# Altium schematic sheet Main.SchDoc
size A2; SheetNumber: 1; SheetTotal: 2; SPICEModelCacheKIWVXNNP: <root> / <DocumentId>KIWVXNNP</DocumentId> / <CacheFrame Number="0"> / <Model Name="cap" Kind="MDL"> / <Text>*Default semiconductor capacitor / .MODEL CAP C()</Text> / </Model> / <Model Name="led2" Kind="MDL"> / <Text>*Typ RED,GREEN,YELLOW,AMBER GaAs LED: Vf=2.1V Vr=4V If=40mA trr=3uS / *LED Pinout: 1=A, 2=K / .MODEL LED2 D (IS=93.1P RS=42M N=4.61 BV=4 IBV=10U / + CJO=2.97P VJ=.75 M=.333 TT=4.32U)</Text> / </Model> / <Model Name="skydiode" Kind="MDL"> / <Text>*Default Schottky Diode / *Schottky Diode Pinout: A,K / .MODEL SKYDIODE D(EG=0.69 XTI=2)</Text> / </Model> / </CacheFrame> / </root>
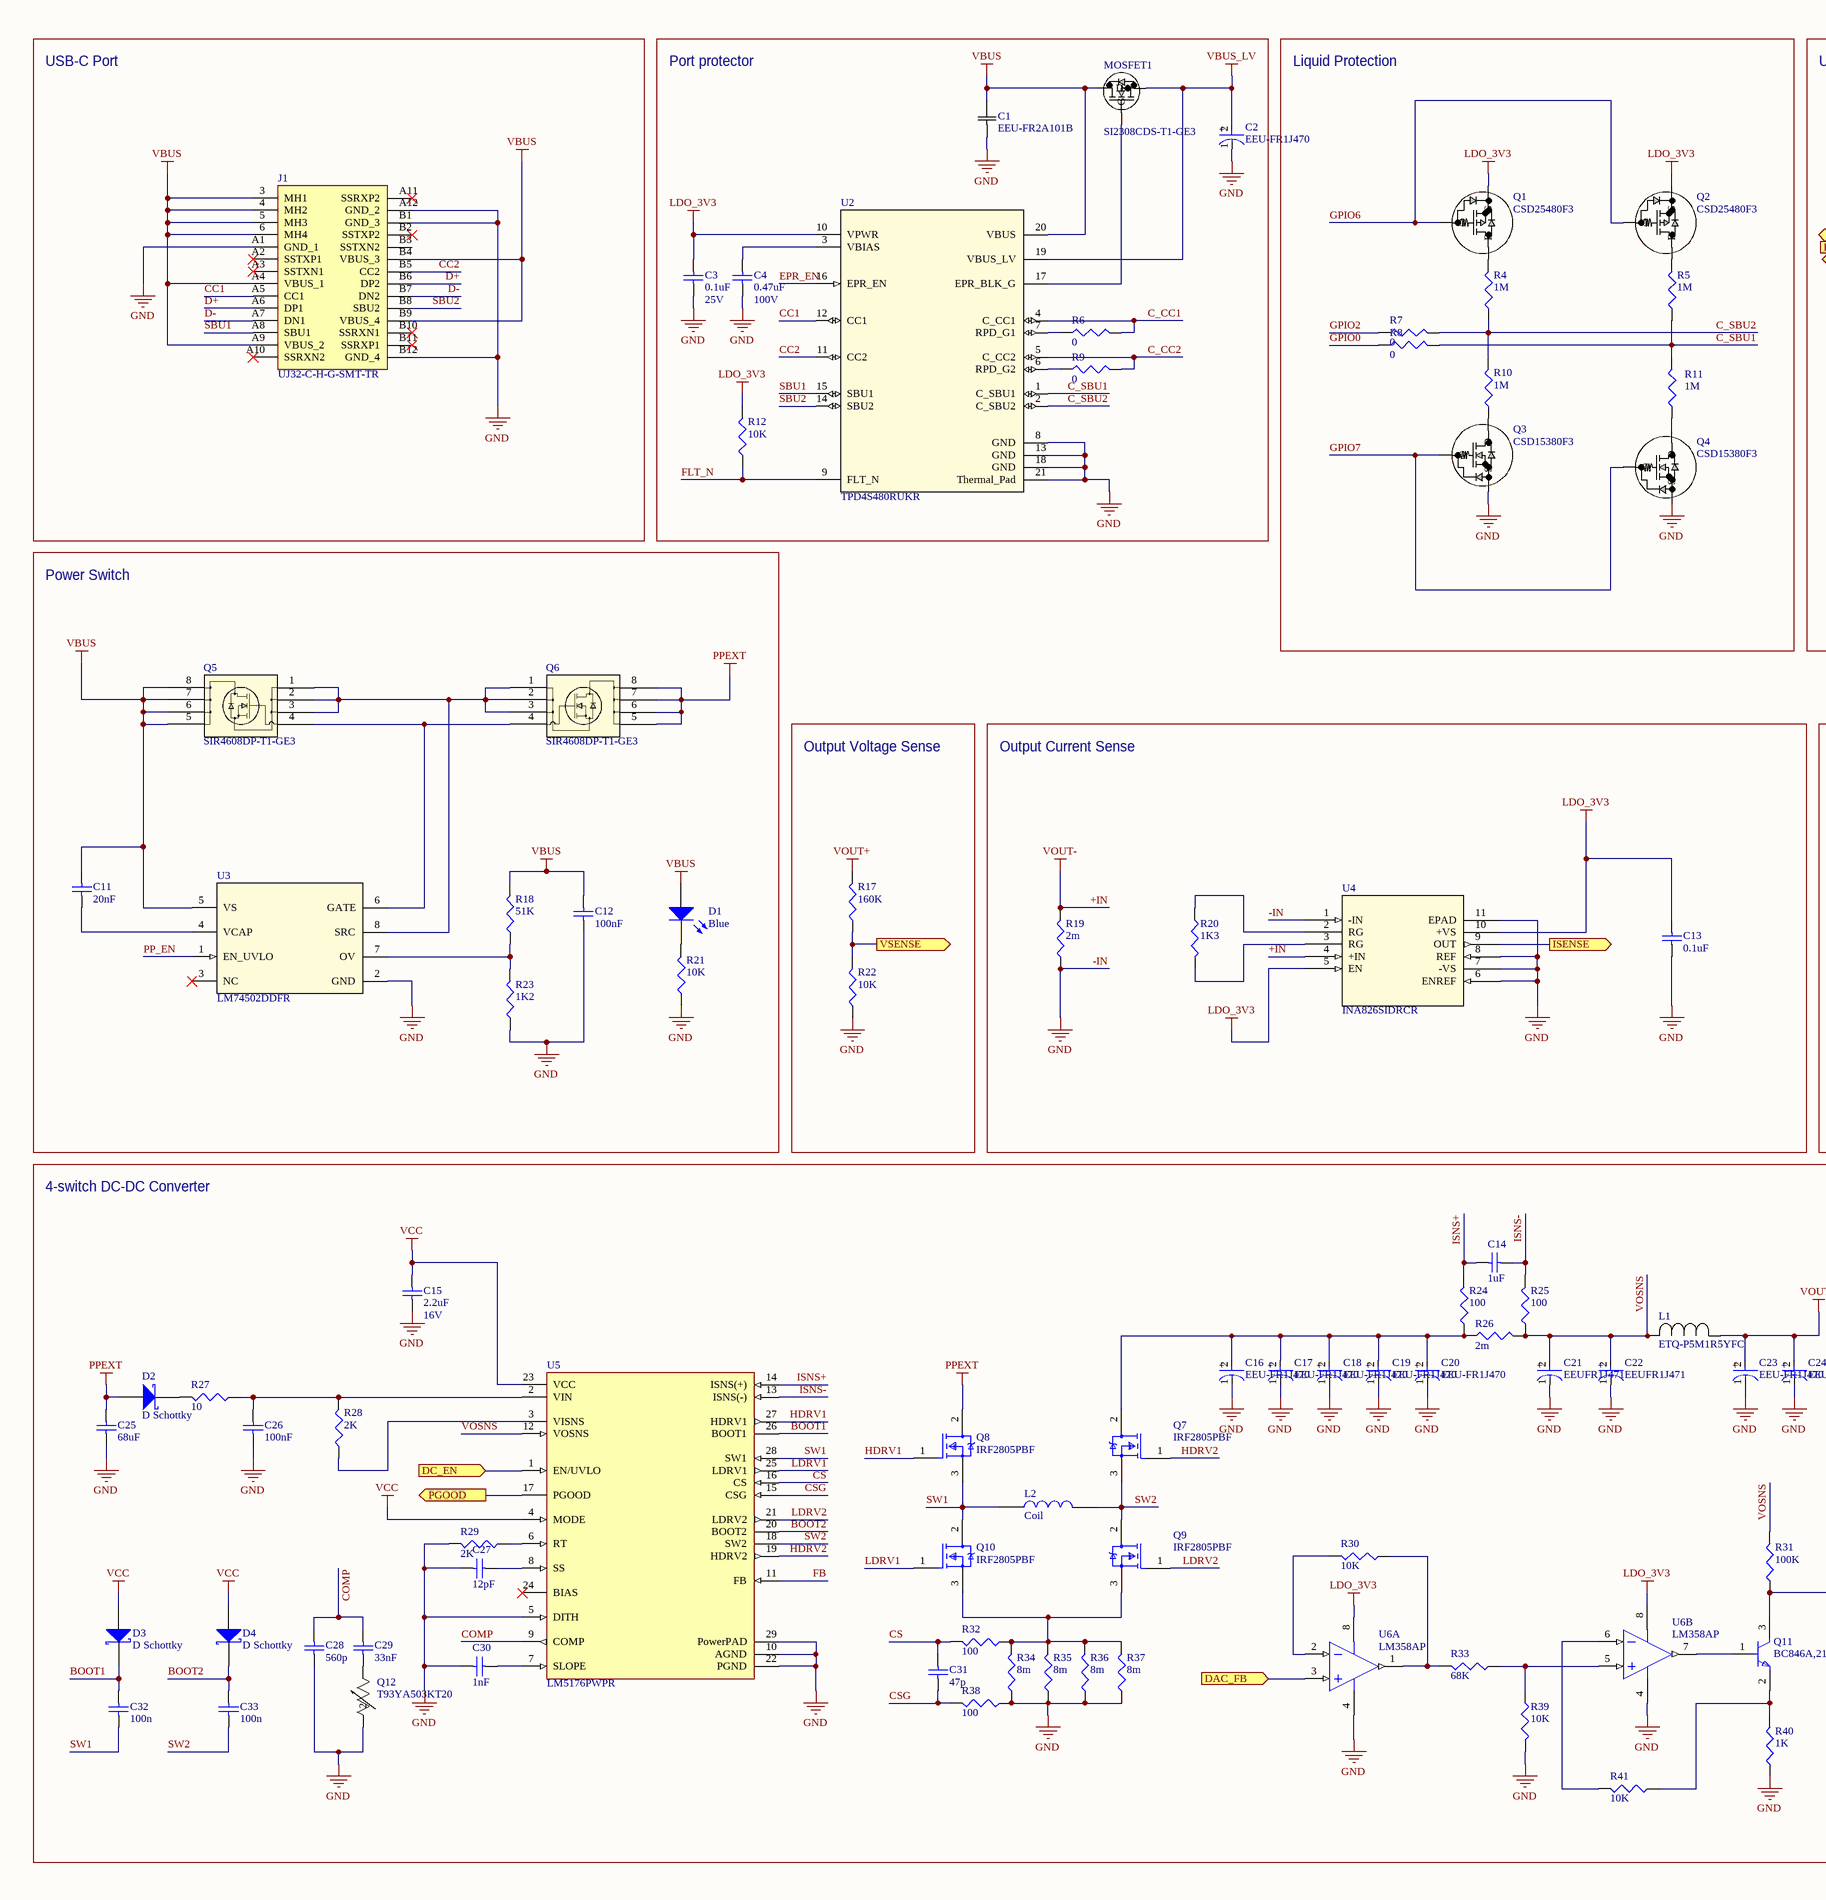
[diagram p0: Main.SchDoc, left]
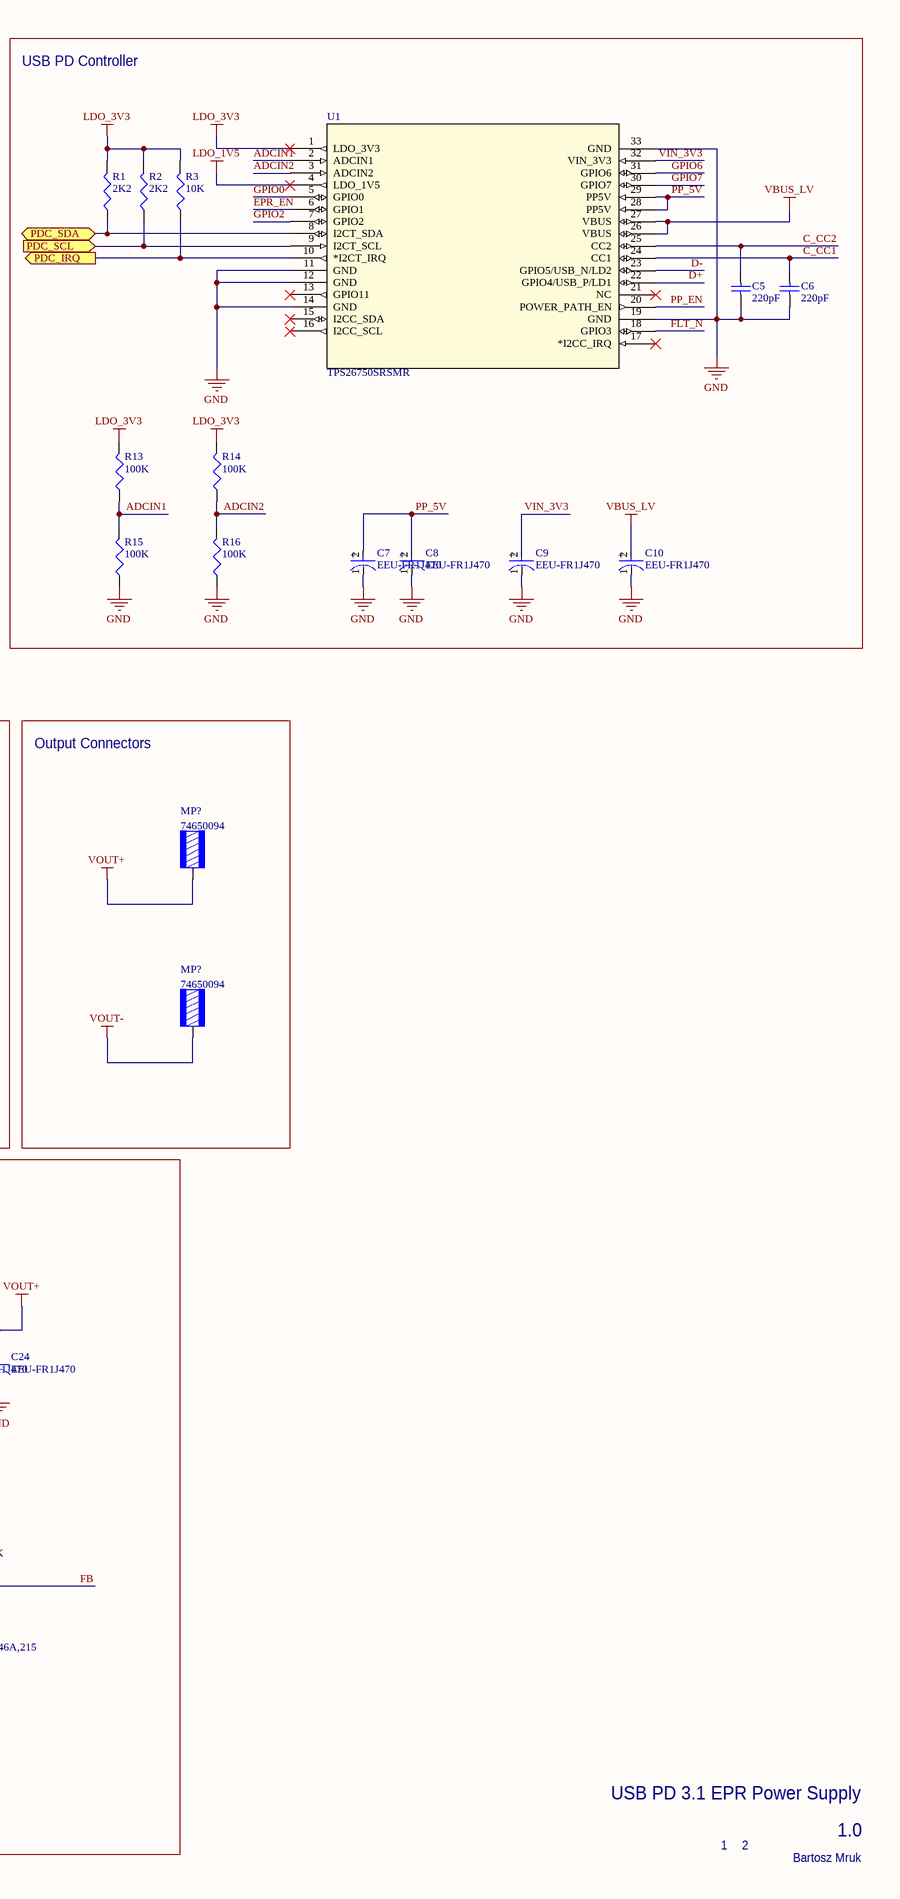
[diagram p1: Main.SchDoc, right]

## Parts
(Parts that share a designator on the sheet are numbered #1, #2 ... from top to bottom, then left to right.)
C1  EEU-FR2A101B  [CAP_EEU-FR2A101B_PAN]
C2  EEU-FR1J470  [FP-EEU-FR1J470-MFG]
C3  25V  value 0.1uF  [C1206]
C4  100V  value 0.47uF  [C1206]
C5  value 220pF  [C1206]  (hidden comment: Cap Semi)
C6  value 220pF  [C1206]  (hidden comment: Cap Semi)
C7  EEU-FR1J470  [FP-EEU-FR1J470-MFG]
C8  EEU-FR1J470  [FP-EEU-FR1J470-MFG]
C9  EEU-FR1J470  [FP-EEU-FR1J470-MFG]
C10  EEU-FR1J470  [FP-EEU-FR1J470-MFG]
C11  value 20nF  [C1206]  (hidden comment: at least 13V)
C12  value 100nF  [C1206]  (hidden comment: Cap Semi)
C13  value 0.1uF  [1608[0603]]
C14  value 1uF  [C1206]  (hidden comment: Cap Semi)
C15  16V  value 2.2uF  [C1206]
C16  EEU-FR1J470  [FP-EEU-FR1J470-MFG]
C17  EEU-FR1J470  [FP-EEU-FR1J470-MFG]
C18  EEU-FR1J470  [FP-EEU-FR1J470-MFG]
C19  EEU-FR1J470  [FP-EEU-FR1J470-MFG]
C20  EEU-FR1J470  [FP-EEU-FR1J470-MFG]
C21  EEUFR1J471  [FP-RAD-TH-D_12_5_0_5-L_25-MFG]
C22  EEUFR1J471  [FP-RAD-TH-D_12_5_0_5-L_25-MFG]
C23  EEU-FR1J470  [FP-EEU-FR1J470-MFG]
C24  EEU-FR1J470  [FP-EEU-FR1J470-MFG]
C25  value 68uF  [C1206]  (hidden comment: Cap Semi)
C26  value 100nF  [C1206]  (hidden comment: Cap Semi)
C27  value 12pF  [C1206]  (hidden comment: Cap Semi)
C28  value 560p  [C1206]  (hidden comment: Cap Semi)
C29  value 33nF  [C1206]  (hidden comment: Cap Semi)
C30  value 1nF  [C1206]  (hidden comment: Cap Semi)
C31  value 47p  [C1206]  (hidden comment: Cap Semi)
C32  value 100n  [C1206]  (hidden comment: Cap Semi)
C33  value 100n  [C1206]  (hidden comment: Cap Semi)
D1  Blue  [3.2X1.6X1.1]
D2  D Schottky  [SMB]
D3  D Schottky  [SMB]
D4  D Schottky  [SMB]
J1  UJ32-C-H-G-SMT-TR  [UJ32CHGSMTTR]
L1  ETQ-P5M1R5YFC  [IND_PCC-M1054M_PAN]
L2  Coil  [744711003]
MOSFET1  SI2308CDS-T1-GE3  [SOT-23_TO-236_VIS]
MP?#1  74650094  [74650094]
MP?#2  74650094  [74650094]
Q1  CSD25480F3  [PICOSTAR3_YJM_TEX]
Q2  CSD25480F3  [PICOSTAR3_YJM_TEX]
Q3  CSD15380F3  [PICOSTAR3_YJM_TEX]
Q4  CSD15380F3  [PICOSTAR3_YJM_TEX]
Q5  SIR4608DP-T1-GE3  [POWERPAK_SO-8_SINGLE_VIS]
Q6  SIR4608DP-T1-GE3  [POWERPAK_SO-8_SINGLE_VIS]
Q7  IRF2805PBF  [FP-PG-TO220-3-MFG]
Q8  IRF2805PBF  [FP-PG-TO220-3-MFG]
Q9  IRF2805PBF  [FP-PG-TO220-3-MFG]
Q10  IRF2805PBF  [FP-PG-TO220-3-MFG]
Q11  BC846A,215  [FP-SOT23-IPC_A]
Q12  T93YA503KT20  [TRIM_503KT20_VIS]
R1  value 2K2  [J1-0603]  (hidden comment: Res3)
R2  value 2K2  [J1-0603]  (hidden comment: Res3)
R3  value 10K  [J1-0603]  (hidden comment: Res3)
R4  value 1M  [J1-0603]  (hidden comment: Res3)
R5  value 1M  [J1-0603]  (hidden comment: Res3)
R6  value 0  [J1-0603]  (hidden comment: Res3)
R7  value 0  [J1-0603]  (hidden comment: Res3)
R8  value 0  [J1-0603]  (hidden comment: Res3)
R9  value 0  [J1-0603]  (hidden comment: Res3)
R10  value 1M  [J1-0603]  (hidden comment: Res3)
R11  value 1M  [J1-0603]  (hidden comment: Res3)
R12  value 10K  [J1-0603]  (hidden comment: Res3)
R13  value 100K  [J1-0603]  (hidden comment: Res3)
R14  value 100K  [J1-0603]  (hidden comment: Res3)
R15  value 100K  [J1-0603]  (hidden comment: Res3)
R16  value 100K  [J1-0603]  (hidden comment: Res3)
R17  value 160K  [J1-0603]  (hidden comment: Res3)
R18  value 51K  [J1-0603]  (hidden comment: Res3)
R19  value 2m  [RESC6332]  (hidden comment: Res3)
R20  value 1K3  [J1-0603]  (hidden comment: Res3)
R21  value 10K  [J1-0603]  (hidden comment: Res3)
R22  value 10K  [J1-0603]  (hidden comment: Res3)
R23  value 1K2  [J1-0603]  (hidden comment: Res3)
R24  value 100  [RESC6332]  (hidden comment: Res3)
R25  value 100  [RESC6332]  (hidden comment: Res3)
R26  value 2m  [RESC6332]  (hidden comment: Res3)
R27  value 10  [J1-0603]  (hidden comment: Res3)
R28  value 2K  [J1-0603]  (hidden comment: Res3)
R29  value 2K  [J1-0603]  (hidden comment: Res3)
R30  value 10K  [J1-0603]  (hidden comment: Res3)
R31  value 100K  [J1-0603]  (hidden comment: Res3)
R32  value 100  [RESC6332]  (hidden comment: Res3)
R33  value 68K  [J1-0603]  (hidden comment: Res3)
R34  value 8m  [RESC6332]  (hidden comment: Res3)
R35  value 8m  [RESC6332]  (hidden comment: Res3)
R36  value 8m  [RESC6332]  (hidden comment: Res3)
R37  value 8m  [RESC6332]  (hidden comment: Res3)
R38  value 100  [RESC6332]  (hidden comment: Res3)
R39  value 10K  [J1-0603]  (hidden comment: Res3)
R40  value 1K  [J1-0603]  (hidden comment: Res3)
R41  value 10K  [J1-0603]  (hidden comment: Res3)
U1  TPS26750SRSMR  [VQFN32_RSM_TEX]
U2  TPD4S480RUKR  [RUK0020B-IPC_A]
U3  LM74502DDFR  [DDF0008A-IPC_A]
U4  INA826SIDRCR  [DRC10_TEX]
U5  LM5176PWPR  [FP-PWP0028C-IPC_C]
U6  LM358AP  [P0008A]  (parts A,B of 2)

## Blocks framed on the sheet
USB-C Port: J1
Port protector: C1-C4 MOSFET1 R6 R9 R12 U2
Liquid Protection: Q1-Q4 R4 R5 R7 R8 R10 R11
USB PD Controller: C5-C10 R1-R3 R13-R16 U1
Power Switch: C11 C12 D1 Q5 Q6 R18 R21 R23 U3
Output Voltage Sense: R17 R22
Output Current Sense: C13 R19 R20 U4
Output Connectors: MP?#1 MP?#2
4-switch DC-DC Converter: C14-C33 D2-D4 L1 L2 Q7-Q12 R24-R41 U5 U6

## Ports
DAC_FB (in, see MicroC[1A]), DC_EN (in, see MicroC[1A]), ISENSE (out, see MicroC[3A]), PDC_IRQ (out, see MicroC[1A]), PDC_SCL (in, see MicroC[1A]), PDC_SDA (bidir, see MicroC[1A]), PGOOD (out, see MicroC[1A]), VSENSE (out, see MicroC[3A])

## Nets
+IN: MP?#2.1 R19.2 U4.4(+IN)  [also labelled VOUT-]
-IN: C1.1 C2.1(C) C3.1 C4.1 C5.1 C6.1 C7.1(C) C8.1(C) C9.1(C) C10.1(C) C12.1 C13.1 C15.1 C16.1(C) C17.1(C) C18.1(C) C19.1(C) C20.1(C) C21.1(C) C22.1(C) C23.1(C) C24.1(C) C25.1 C26.1 C27.2 C28.1 C30.2 J1.A1(GND_1) J1.A12(GND_2) J1.B1(GND_3) J1.B12(GND_4) Q3.2(S) Q4.2(S) Q12.2 R15.1 R16.1 R19.1 R21.1 R22.1 R23.1 R29.2 R34.1 R35.1 R36.1 R37.1 R38.1 R39.2 R40.1 U1.11(GND) U1.12(GND) U1.14(GND) U1.19(GND) U1.33(GND) U2.8(GND) U2.13(GND) U2.18(GND) U2.21(Thermal_Pad) U3.2(GND) U4.1(-IN) U4.6(ENREF) U4.7(-VS) U4.8(REF) U4.11(EPAD) U5.5(DITH) U5.10(AGND) U5.22(PGND) U5.29(PowerPAD) U6.4(GND)  [also labelled GND]
LDO_1V5: U1.4(LDO_1V5)
LDO_3V3: C3.2 C13.2 Q1.2(S) Q2.2(S) R1.2 R2.2 R3.2 R12.2 R13.2 R14.2 U1.1(LDO_3V3) U2.10(VPWR) U4.5(EN) U4.10(+VS) U6.8(VCC)
PPEXT: C25.2 D2.1(A) Q6.5 Q6.6 Q6.7 Q6.8 Q8.2(D)
VBUS: C1.2 C11.2 C12.2 D1.1(A) J1.3(MH1) J1.4(MH2) J1.5(MH3) J1.6(MH4) J1.A4(VBUS_1) J1.A9(VBUS_2) J1.B4(VBUS_3) J1.B9(VBUS_4) MOSFET1.2(D) Q5.5 Q5.6 Q5.7 Q5.8 R18.2 U2.20(VBUS) U3.5(VS)
VBUS_LV: C2.2(A) C10.2(A) MOSFET1.3(S) U1.26(VBUS) U1.27(VBUS) U2.19(VBUS_LV)
VCC: C15.2 D3.1(A) D4.1(A) U5.4(MODE) U5.23(VCC)
VOUT+: C23.2(A) C24.2(A) L1.1 MP?#1.1 R17.2
ADCIN1: R13.1 R15.2 U1.2(ADCIN1)
ADCIN2: R14.1 R16.2 U1.3(ADCIN2)
BOOT1: C32.2 D3.2(K) U5.26(BOOT1)
BOOT2: C33.2 D4.2(K) U5.20(BOOT2)
C_CC1: C6.2 R6.2 U1.24(CC1) U2.4(C_CC1)
C_CC2: C5.2 R9.2 U1.25(CC2) U2.5(C_CC2)
C_SBU1: R5.1 R8.2 R11.2 U2.1(C_SBU1)
C_SBU2: R4.1 R7.2 R10.2 U2.2(C_SBU2)
CC1: J1.A5(CC1) U2.12(CC1)
CC2: J1.B5(CC2) U2.11(CC2)
COMP: C28.2 C29.2 U5.9(COMP)
CS: C31.2 R32.2 U5.16(CS)
CSG: C31.1 R38.2 U5.15(CSG)
D+: J1.A6(DP1) J1.B6(DP2) U1.22(GPIO4/USB_P/LD1)
D-: J1.A7(DN1) J1.B7(DN2) U1.23(GPIO5/USB_N/LD2)
DAC_FB: U6.3(1IN+) ; port DAC_FB
DC_EN: U5.1(EN/UVLO) ; port DC_EN
EPR_EN: U1.6(GPIO1) U2.16(EPR_EN)
FB: Q11.3(C) R31.1 U5.11(FB)
FLT_N: R12.1 U1.18(GPIO3) U2.9(FLT_N)
GPIO0: R8.1 U1.5(GPIO0)
GPIO2: R7.1 U1.7(GPIO2)
GPIO6: Q1.1(G) Q2.1(G) U1.31(GPIO6)
GPIO7: Q3.1(G) Q4.1(G) U1.30(GPIO7)
HDRV1: Q8.1(G) U5.27(HDRV1)
HDRV2: Q7.1(G) U5.19(HDRV2)
ISENSE: U4.9(OUT) ; port ISENSE
ISNS+: C14.1 R24.2 U5.14(ISNS(+))
ISNS-: C14.2 R25.2 U5.13(ISNS(-))
LDRV1: Q10.1(G) U5.25(LDRV1)
LDRV2: Q9.1(G) U5.21(LDRV2)
PDC_IRQ: R3.1 U1.10(*I2CT_IRQ) ; port PDC_IRQ
PDC_SCL: R2.1 U1.9(I2CT_SCL) ; port PDC_SCL
PDC_SDA: R1.1 U1.8(I2CT_SDA) ; port PDC_SDA
PGOOD: U5.17(PGOOD) ; port PGOOD
PP_5V: C7.2(A) C8.2(A) U1.28(PP5V) U1.29(PP5V)
PP_EN: U1.20(POWER_PATH_EN) U3.1(EN_UVLO)
SBU1: J1.A8(SBU1) U2.15(SBU1)
SBU2: J1.B8(SBU2) U2.14(SBU2)
SW1: C32.1 L2.1 Q8.3(S) Q10.2(D) U5.28(SW1)
SW2: C33.1 L2.2 Q7.3(S) Q9.2(D) U5.18(SW2)
VIN_3V3: C9.2(A) U1.32(VIN_3V3)
VOSNS: C21.2(A) C22.2(A) L1.2 R25.1 R26.2 R31.2 U5.12(VOSNS)
VSENSE: R17.1 R22.2 ; port VSENSE
NetC4_2: C4.2 U2.3(VBIAS)
NetC11_1: C11.1 U3.4(VCAP)
NetC16_2: C16.2(A) C17.2(A) C18.2(A) C19.2(A) C20.2(A) Q7.2(D) R24.1 R26.1
NetC26_2: C26.2 R27.1 R28.2 U5.2(VIN)
NetC27_1: C27.1 U5.8(SS)
NetC29_1: C29.1 Q12.1
NetC30_1: C30.1 U5.7(SLOPE)
NetD1_2: D1.2(K) R21.2
NetD2_2: D2.2(K) R27.2
NetMOSFET1_1: MOSFET1.1(G) U2.17(EPR_BLK_G)
NetQ1_3: Q1.3(D) R4.2
NetQ2_3: Q2.3(D) R5.2
NetQ3_3: Q3.3(D) R10.1
NetQ4_3: Q4.3(D) R11.1
NetQ5_1: Q5.1 Q5.2 Q5.3 Q6.1 Q6.2 Q6.3 U3.8(SRC)
NetQ5_4: Q5.4 Q6.4 U3.6(GATE)
NetQ9_3: Q9.3(S) Q10.3(S) R32.1 R34.2 R35.2 R36.2 R37.2
NetQ11_1: Q11.1(B) U6.7(2OUT)
NetQ11_2: Q11.2(E) R40.2 R41.1
NetR6_1: R6.1 U2.7(RPD_G1)
NetR9_1: R9.1 U2.6(RPD_G2)
NetR18_1: R18.1 R23.2 U3.7(OV)
NetR20_1: R20.1 U4.2(RG)
NetR20_2: R20.2 U4.3(RG)
NetR28_1: R28.1 U5.3(VISNS)
NetR29_1: R29.1 U5.6(RT)
NetR30_1: R30.1 R33.2 U6.1(1OUT)
NetR30_2: R30.2 U6.2(1IN-)
NetR33_1: R33.1 R39.1 U6.5(2IN+)
NetR41_2: R41.2 U6.6(2IN-)

Not connected (* = marked no-connect by the designer): J1 A2(SSTXP1)* A3(SSTXN1)* A10(SSRXN2)* A11(SSRXP2)* B2(SSTXP2)* B3(SSTXN2) B10(SSRXN1)* B11(SSRXP1)*; U1 13(GPIO11)* 15(I2CC_SDA)* 16(I2CC_SCL)* 17(*I2CC_IRQ)* 21(NC)*; U3 3(NC)*; U5 24(BIAS)*

## Notes on the sheet
- USB PD 3.1 EPR Power Supply
- 1
- 2
- 1.0
- Bartosz Mruk
- (in symbol CMP-05427-000066-1) +
- (in symbol CMP-05427-000281-1) +

## Library data of the parts
C1 = EEU-FR2A101B: No Description Available; Manufacturer_Name: Panasonic; Copyright: Copyright (C) 2025 Ultra Librarian. All rights reserved.; Manufacturer_Part_Number: EEU-FR2A101B
C2 C7-C10 C16-C20 C23 C24 = CMP-05427-000066-1: CAP ALUM 47UF 20% 63V RADIAL; ESR (Equivalent Series Resistance): 210mR; Lead Diameter: 0.5mm; Life (Hours): 5000Hour; Ripple Current (AC): 284mA; Height - Seated (Max): 0.5inch; Radiation Hardening: No; Termination: Radial; Contact Plating: Tin; Length: 11.2mm; Tolerance: 20%; Voltage: 63V; Max Operating Temperature: 105°C; Construction: Cylindrical; Lead Free: Lead Free; Series: FR; Mount: Through Hole; Lead Pitch: 2.5mm; Capacitance: 47uF; Case/Package: Radial; Voltage Rating (DC): 63V; Diameter: 6.3mm; Impedance: 210mR; RoHS Compliant: Yes; Height: 11.2mm; REACH SVHC: No SVHC; Package Quantity: 200; Ripple Current: 284mA; Voltage Rating: 63V; Packaging: Bulk; Min Operating Temperature: -40°C
C3-C6 C11-C15 C25-C33 = Cap Semi: Capacitor (Semiconductor SIM Model); Published: 8-Jun-2000; LatestRevisionDate: 29-May-2009; LatestRevisionNote: IPC-7351 Footprint Added.; PackageReference: C1206; Publisher: Altium Limited; PackageDescription: Chip Capacitor
C21 C22 = CMP-05427-000281-1: Aluminum Electrolytic Capacitors (Radial Lead Type) 470uF ±20% 63V; Impedance: 27mR; Lead Diameter: 0.6mm; Ripple Current: 1.995A; Life (Hours): 10000Hour; Series: FR; Tolerance: 20%; Max Operating Temperature: 105°C; Diameter: 12.5mm; Height - Seated (Max): 1.063inch; Termination: Radial; Voltage Rating: 63V; Contact Plating: Tin; Height: 25mm; Case/Package: Radial; Packaging: Bulk; Length: 25mm; Mount: Through Hole; Construction: Cylindrical; Package Quantity: 100; Ripple Current (AC): 1.995A; Radiation Hardening: No; Voltage: 63V; Capacitance: 470uF; RoHS Compliant: Yes; Min Operating Temperature: -40°C; ESR (Equivalent Series Resistance): 27mR; Lead Free: Lead Free; Lead Pitch: 5mm; Voltage Rating (DC): 63V
D1 = LED2: Typical RED, GREEN, YELLOW, AMBER GaAs LED; Published: 8-Jun-2000; LatestRevisionDate: 17-Jul-2002; LatestRevisionNote: Re-released for DXP Platform.; PackageVersion: Feb-2002; PackageReference: 3.2X1.6X1.1; Publisher: Altium Limited; PackageDescription: SM LED; 2 Flat Leads
D2-D4 = D Schottky: Schottky Diode; Published: 8-Jun-2000; LatestRevisionDate: 17-Jul-2002; LatestRevisionNote: Re-released for DXP Platform.; PackageReference: SMB; Publisher: Altium Limited; PackageDescription: DO-214-AA/SMB; 2 C-Bend Leads; Body 5.3 x 3.6 mm, inc. leads (LxW); Code_JEDEC: DO-214-AA
J1 = UJ32-C-H-G-SMT-TR: UJ32-C-H-G-SMT-TR - Type C, USB 3.2 Gen 2x2, 20 Gbps, 20 Vac, 5 A, Right Angle, Gold Flash, Surface Mount, Black Insulator, USB Receptacle; Manufacturer_Name: Same Sky; Geometry.Height: 3.71mm; Mouser Part Number: 179-UJ32CHGSMTTR; Mouser Price/Stock: https://www.mouser.co.uk/ProductDetail/CUI-Devices/UJ32-C-H-G-SMT-TR?qs=vvQtp7zwQdNJg60%252BwYKIHw%3D%3D; Manufacturer_Part_Number: UJ32-C-H-G-SMT-TR; Datasheet Link: https://www.sameskydevices.com/product/resource/UJ32-C-H-G-SMT-TR.pdf
L1 = ETQ-P5M1R5YFC: No Description Available; Manufacturer_Name: Panasonic; Copyright: Copyright (C) 2025 Ultra Librarian. All rights reserved.; Manufacturer_Part_Number: ETQ-P5M1R5YFC
MOSFET1 = SI2308CDS-T1-GE3: N-CHANNEL 60-V (D-S) MOSFET; Manufacturer_Name: Vishay; Copyright: Copyright (C) 2025 Ultra Librarian. All rights reserved.; Manufacturer_Part_Number: SI2308CDS-T1-GE3
MP?#1 MP?#2 = CMP-03913-89699612-2: WP-THRBU REDCUBE Bush, THR_open; Current Rating: 85A; Packaging: Bulk; Min Operating Temperature: -55°C; Number of Pins: 8; Height: 3mm; RoHS: Compliant; Width: 10mm; Max Operating Temperature: 150°C; Material: Brass
Q1 Q2 = CSD25480F3: -20-V, P channel NexFETâ„¢ power MOSFET, single LGA 0.6 mm x 0.7 mm, 159 mOhm, gate ESD protection 3-PICOSTAR -55 to 150; Manufacturer_Name: Texas Instruments; Type: Transistors; Copyright: Copyright (C) 2025 Ultra Librarian. All rights reserved.; Manufacturer_Part_Number: CSD25480F3
Q3 Q4 = CSD15380F3: 20-V, N channel NexFETâ„¢ power MOSFET, single LGA 0.6 mm x 0.7 mm, 1460 mOhm, gate ESD protection 3-PICOSTAR -55 to 150; Manufacturer_Name: Texas Instruments; Type: Transistors; Copyright: Copyright (C) 2025 Ultra Librarian. All rights reserved.; Manufacturer_Part_Number: CSD15380F3
Q5 Q6 = SIR4608DP-T1-GE3: N-CHANNEL 60-V (D-S) MOSFET; Manufacturer_Name: Vishay; Copyright: Copyright (C) 2025 Ultra Librarian. All rights reserved.; Manufacturer_Part_Number: SIR4608DP-T1-GE3; RefDes: RefDes; Type: Type
Q7-Q10 = CMP-32901-001056-1: MOSFET N-CH 55V 75A TO220AB; Element Configuration: Single; Drain to Source Resistance: 4.7mR; Power Dissipation: 330W; Threshold Voltage: 4V; Turn-On Delay Time: 14ns; Gate to Source Voltage (Vgs): 20V; Polarization: N; Turn-Off Delay Time: 68ns; Input Capacitance: 5.11nF; Max Dual Supply Voltage: 55V; Number of Pins: 3; RoHS Compliant: Yes; REACH SVHC: No SVHC; Case/Package: TO-220; Rds On Max: 4.7mR; Width: 0.19inch; Min Operating Temperature: -55°C; Drain to Source Breakdown Voltage: 55V; Packaging: Rail/Tube; Lead Free: Lead Free; Length: 0.42inch; Max Operating Temperature: 175°C; Series: HEXFET®; Drain to Source Voltage (Vdss): 55V; Max Power Dissipation: 330W; Continuous Drain Current (ID): 75A; Height: 0.65inch; Halogen Free: Halogen Free; Mount: Through Hole
Q11 = CMP-14406-000010-1: TRANS NPN 65V 0.1A SOT23; Manufacturer: Nexperia; Collector Emitter Saturation Voltage: 200mV; Hfe Max: 450; Number Of Npn: 1; Max Junction Temp: +150°C; Hfe Min: 110; Power Dissipation: 250mW; Collector Base Voltage: 80V; Unity Gain Freq: 100MHz; Hfe Testvce: 5V; Emitter Base Voltage: 6V; Max Collector Current: 100mA; Rthja Max: 500K/W; Hfe Testic: 2mA; Automotive Grade: Grade 0; Temperature: to +150°C; Category: Trans; Octopart: https://octopart.com/bc846a%2C215-nexperia-78739089; Device Class L2: Transistors; ComponentLink2Description: Datasheet; Collector Emitter Voltage: 65V; Device Class L1: Discrete Semiconductors; Digikey Description: TRANS NPN 65V 0.1A SOT23; Package: SOT23; Manufacturer Part Number: BC846A,215; Footprint Url: https://assets.nexperia.com/documents/outline-drawing/SOT23.pdf; RoHS: TRUE; Device Class L3: BJTs; Ambient Temperature Range Low: -65°C; ComponentLink2URL: https://assets.nexperia.com/documents/data-sheet/BC846_SER.pdf; Temperature Range High: +150°C; Lead Free: Yes; Height: 1.1mm; Mouser Description: BC846 Series 65 V 100 mA NPN SMT General Purpose Transistor - SOT-23; Automotive: Yes; Number Of Elements: 1; Ambient Temperature Range High: +150°C
Q12 = T93YA503KT20: T93 YA 50K 10% TU50 e3; Manufacturer_Name: Vishay; Type: Trimmer Potentiometers; Copyright: Copyright (C) 2025 Ultra Librarian. All rights reserved.; Manufacturer_Part_Number: T93YA503KT20; Datasheet: https://www.vishay.com/doc?51026
R1-R41 = Res3: Resistor; Published: 8-Jun-2000; LatestRevisionDate: 29-May-2009; LatestRevisionNote: IPC-7351 Footprint Added.; PackageReference: J1-0603; Publisher: Altium Limited; PackageDescription: Chip Resistor
U1 = TPS26750SRSMR: USB Type-CÂ® and USB Power Delivery (PD) 3.1 controller with 240-W extended power range support  32-VQFN -40 to 125; Manufacturer_Name: Texas Instruments; Copyright: Copyright (C) 2025 Ultra Librarian. All rights reserved.; Manufacturer_Part_Number: TPS26750SRSMR; RefDes: RefDes; Type: Type
U2 = TPD4S480RUKR: USB Type-Câ„¢ 48V EPR port protector with short-to-VBUS overvoltage and IEC ESD protection 20-WQFN -40 to 125; Manufacturer_Name: Texas Instruments; TYPE: TYPE; RefDes: RefDes; Copyright: Copyright (C) 2025 Ultra Librarian. All rights reserved.; Manufacturer_Part_Number: TPD4S480RUKR
U3 = LM74502DDFR: 3.2-V to 65-V industrial RPP controller with load disconnect and OVP 8-SOT-23-THIN -40 to 125; Manufacturer_Name: Texas Instruments; TYPE: TYPE; RefDes: RefDes; Copyright: Copyright (C) 2025 Ultra Librarian. All rights reserved.; Manufacturer_Part_Number: LM74502DDFR
U4 = INA826SIDRCR: 200 Î¼A, 36V, Rail-to-Rail Out Instrumentation Amplifier with Shutdown 10-VSON -40 to 125; Manufacturer_Name: Texas Instruments; Copyright: Copyright (C) 2025 Ultra Librarian. All rights reserved.; Manufacturer_Part_Number: INA826SIDRCR; Datasheet: https://www.ti.com/lit/gpn/ina826s; RefDes: RefDes; Type: Type
U5 = CMP-04918-000350-1: Switching Frequency: 600kHz; Max Duty Cycle: 100%; Number of Output Phases: 1; Output Configuration: Positive; Clock Sync: Yes; Topology: Buck-Boost; Packaging: Tape and Reel; Number of Outputs: 1; Number of Pins: 28; Min Operating Temperature: -40°C; Max Operating Temperature: 125°C; Synchronous Rectifier: Yes; RoHS Compliant: Yes
U6 = CMP-1685-00017-1: Dual Operational Amplifier, 3 to 32 V, 0 to 70 degC, 8-Pin PDIP (P), Pb-Free (RoHS), Tube; Case\Package: 0603; Luminous Intensity: 90 mcd; Viewing Angle: 130 degrees; Nominal Vf: 2 V; Lens Style: Diffused; Illumination Colour: Orange; Power Rating: 75 mW; Forward Current: 20 mA; Pins: 2; ComponentLink3Description: Package Specification; Packaging: Tape and Reel; Mount: Surface Mount; PackageReference: P0008A; Radiation Hardening: No; ComponentLink3URL: http://www.ti.com/lit/ml/mpdi001b/mpdi001b.pdf; Case Code (Metric): 1608; ComponentLink2Description: Datasheet; Max Operating Temperature: 85 degC; ComponentLink1Description: Manufacturer URL; RoHSCompliant: true; Width: 0.8 mm; Length: 1.6 mm; DatasheetVersion: SLOS068T, 04/2015; Min Operating Temperature: -55 degC; Height: 1.1 mm; Colour: Orange; ComponentLink2URL: http://www.ti.com/lit/ds/symlink/lm358a.pdf; PackageDescription: 8-Pin Double In-line Package, Body 9.59 x 6.35 mm, Pitch 2.54 mm; PackageVersion: 4040082/E, 04/2010; Forward Voltage: 2 V; Package Quantity: 3000; Case Code (Imperial): 0603; ComponentLink1URL: http://www.ti.com/